# Altium schematic sheet Data Logger.SchDoc
size A; SheetNumber: 5; SheetTotal: 5
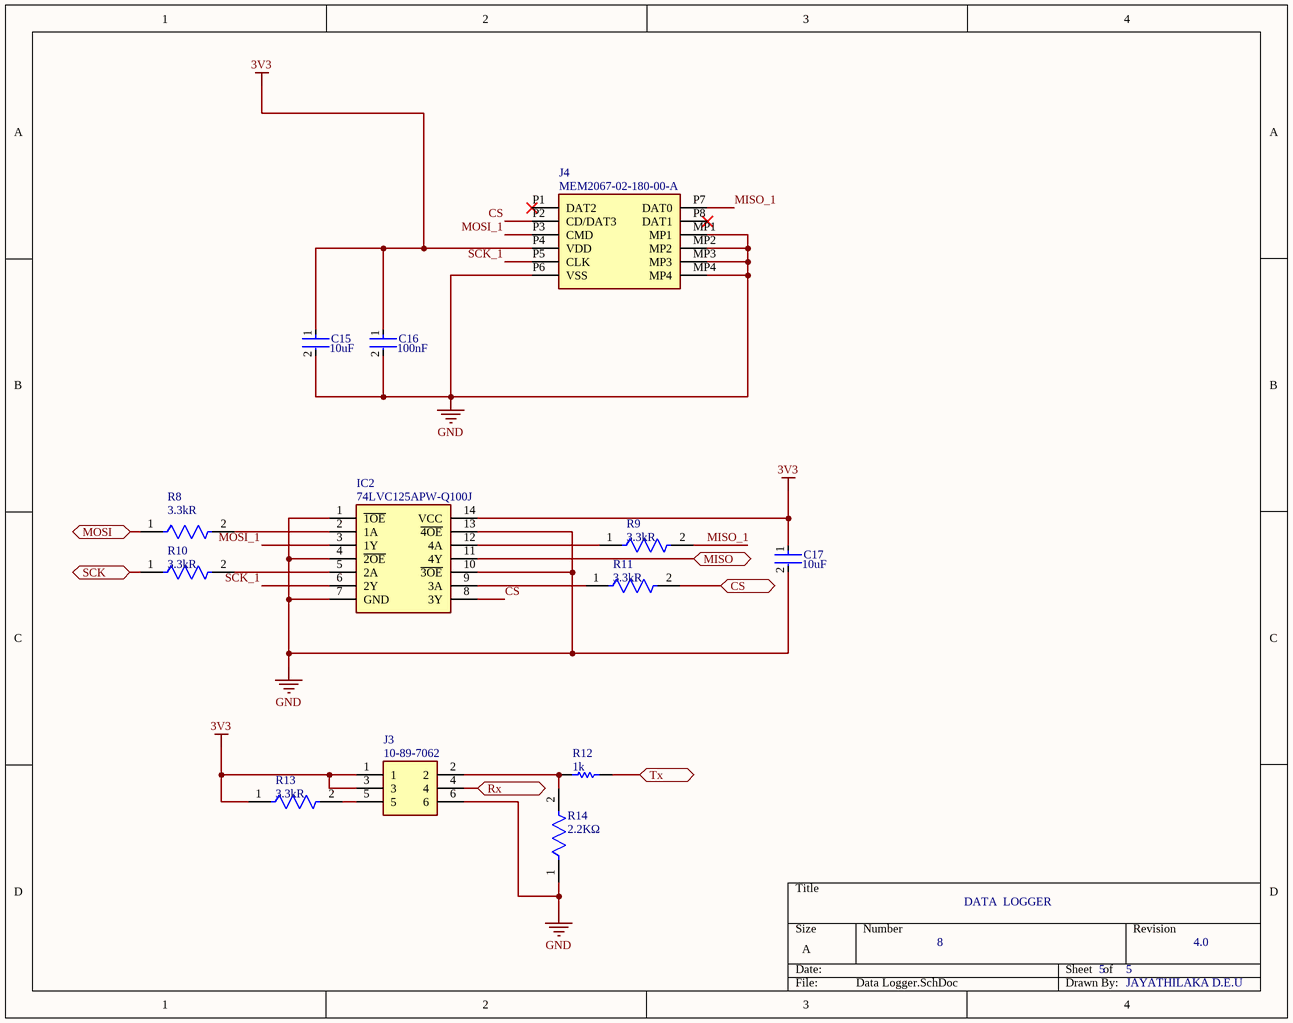
[diagram p0: Data Logger.SchDoc]

## Parts
C15  value 10uF  [FP-CL31B106KBHNNNE-MFG]  (hidden comment: CL31B106KBHNNNE)
C16  Capacitance: 100nF  [FP-GRM31C-0_2-e0_3_0_8-IPC_B]  (hidden comment: GRM31C5C1H104JA01L)
C17  value 10uF  [FP-CL31B106KBHNNNE-MFG]  (hidden comment: CL31B106KBHNNNE)
IC2  74LVC125APW-Q100J  [SOP65P640X110-14N]
J3  10-89-7062  [HDRV6W87P254_2X3_775X508X864P]
J4  MEM2067-02-180-00-A  [MEM20670218000A]
R8  Resistance: 3.3kR  [FP-CRCW1206-e3-MFG]  (hidden comment: CRCW12063K30FKEA)
R9  Resistance: 3.3kR  [FP-CRCW1206-e3-MFG]  (hidden comment: CRCW12063K30FKEA)
R10  Resistance: 3.3kR  [FP-CRCW1206-e3-MFG]  (hidden comment: CRCW12063K30FKEA)
R11  Resistance: 3.3kR  [FP-CRCW1206-e3-MFG]  (hidden comment: CRCW12063K30FKEA)
R12  value 1k  [RESC3116X65X40ML10T20]  (hidden comment: RT1206FRE071KL)
R13  Resistance: 3.3kR  [FP-CRCW1206-e3-MFG]  (hidden comment: CRCW12063K30FKEA)
R14  value 2.2KΩ  [FP-RT1206-MFG]  (hidden comment: RT1206BRD072K2L)

## Ports
CS (bidir, see Farm Assistor[4B], MCU[2C]), MISO (bidir, see Farm Assistor[4B], MCU[3C]), MOSI (bidir, see Farm Assistor[4B], MCU[3C]), Rx (bidir, see Farm Assistor[4B], MCU[2B]), SCK (bidir, see Farm Assistor[4B], MCU[3C]), Tx (bidir, see Farm Assistor[4B], MCU[2B])

## Nets
3V3: C15.1 C16.1 C17.1 IC2.14(VCC) J3.1 J3.3 J4.P4(VDD) R13.1
GND: C15.2 C16.2 C17.2 IC2.1(~{1OE}) IC2.4(~{2OE}) IC2.7(GND) IC2.10(~{3OE}) IC2.13(~{4OE}) J3.6 J4.MP1 J4.MP2 J4.MP3 J4.MP4 J4.P6(VSS) R14.1
CS: IC2.8(3Y) J4.P2(CD/DAT3)
CS: R11.2 ; port CS  [a separate net that carries the same name]
MISO: IC2.11(4Y) ; port MISO
MISO_1: J4.P7(DAT0) R9.2
MOSI: R8.1 ; port MOSI
MOSI_1: IC2.3(1Y) J4.P3(CMD)
Rx: J3.4 ; port Rx
SCK: R10.1 ; port SCK
SCK_1: IC2.6(2Y) J4.P5(CLK)
Tx: R12.2 ; port Tx
NetIC2_2: IC2.2(1A) R8.2
NetIC2_5: IC2.5(2A) R10.2
NetIC2_9: IC2.9(3A) R11.1
NetIC2_12: IC2.12(4A) R9.1
NetJ3_2: J3.2 R12.1 R14.2
NetJ3_5: J3.5 R13.2

Not connected (* = marked no-connect by the designer): J4 P1(DAT2)* P8(DAT1)*

## Notes on the sheet
- DATA  LOGGER
- 8
- 5
- 4.0
- JAYATHILAKA D.E.U

## Library data of the parts
C15 C17 = CMP-2000-07530-2: CAP CER 10UF 50V X7R 1206; Manufacturer: Samsung; Tolerance: 10%; Material: Ceramic; Temperature Coefficient: 15%; Temperature Characteristic: X7R; Digikey Description: CAP CER 10UF 50V X7R 1206; Device Class L1: Passive Components; Lead Free: Yes; Device Class L3: Ceramic Capacitors; Octopart: https://octopart.com/cl31b106kbhnnne-samsung-30507377; ComponentLink2URL: http://www.samsungsem.com/global/front/downloadcms.do?path=%2F%2Fglobal%2F%2Fsupport%2F%2Fproduct-search%2F%2Fmlcc%2F%2F__icsFiles%2F%2Fafieldfile%2F%2F2019%2F%2F06%2F%2F18&fileName=CL31B106KBHNNNE-19.pdf; Voltage Rating: 50V; Temperature Range Low: -55°C; RoHS: TRUE; Temperature: -55°C to +125°C; Category: Cap; ComponentLink2Description: Datasheet; Manufacturer Part Number: CL31B106KBHNNNE; Automotive: No; Device Class L2: Capacitors; Capacitance: 10uF; Height: 1.8mm; Temperature Range High: +125°C; Package: CL31B106KBHNNNE
C16 = CMP-06035-003994-1: Chip Multilayer Ceramic Capacitors for General Purpose, 1206, 0.10uF, C0G, 30ppm/°C, 5%, 50V; Voltage: 50V; Package Quantity: 1; Min Operating Temperature: -55°C; Termination: SMD/SMT; Voltage Rating (DC): 50V; Thickness: 0.071inch; Max Operating Temperature: 125°C; Mount: Surface Mount; Height: 1.6mm; Weight: 0.000571oz; Length: 3.2mm; Case Code (Imperial): 1206; Tolerance: 5%; Lead Free: Lead Free; Material: Ceramic; REACH SVHC: No SVHC; Depth: 1.6mm; Case/Package: 1206; Radiation Hardening: No; Temperature Coefficient: 30ppm/°C; Packaging: Tape and Reel; Case Code (Metric): 3216; Dielectric: C0G; Width: 0.063inch; Voltage Rating: 50V
IC2 = 74LVC125APW-Q100J: Integrated Circuit; Manufacturer_Name: Nexperia; Datasheet Link: https://assets.nexperia.com/documents/data-sheet/74LVC125A_Q100.pdf; Height: 1.1mm; Manufacturer_Part_Number: 74LVC125APW-Q100J; Mouser Part Number: 771-74LVC125APWQ100J; Mouser Price/Stock: https://www.mouser.co.uk/ProductDetail/Nexperia/74LVC125APW-Q100J?qs=fi7yB2oewZnvEQIDK5FFLg%3D%3D; Arrow Part Number: 74LVC125APW-Q100J; Arrow Price/Stock: https://www.arrow.com/en/products/74lvc125apw-q100j/nexperia?region=europe
J3 = 10-89-7062: Connector; Manufacturer_Name: Molex; Datasheet Link: https://componentsearchengine.com/Datasheets/1/10-89-7062.pdf; Height: 8.64mm; Manufacturer_Part_Number: 10-89-7062; Mouser Part Number: 538-10-89-7062; Mouser Price/Stock: https://www.mouser.co.uk/ProductDetail/Molex/10-89-7062?qs=tRPrwvvr%2Fuh8n6rY9aRt4Q%3D%3D
J4 = MEM2067-02-180-00-A: Connector; Manufacturer_Name: GCT (GLOBAL CONNECTOR TECHNOLOGY); Datasheet Link: https://gct.co/files/drawings/mem2067.pdf; Height: 1.95mm; Manufacturer_Part_Number: MEM2067-02-180-00-A; Mouser Part Number: 640-MEM20670218000A; Mouser Price/Stock: https://www.mouser.co.uk/ProductDetail/GCT/MEM2067-02-180-00-A?qs=KUoIvG%2F9IlYTw%2Fcc1GlNJA%3D%3D
R8-R11 R13 = CMP-2100-03617-2: RES Thick Film, 3.3kΩ, 1%, 0.25W, 100ppm/°C, 1206; Max Power Dissipation: 250mW; Voltage Rating (DC): 200V; Tolerance: 1%; Length: 3.2mm; Case Code (Metric): 3216; Contact Plating: Tin; Radiation Hardening: No; Lead Free: Lead Free; Max Operating Temperature: 155°C; Packaging: Tape and Reel; Power Rating: 250mW; Features: Automotive AEC-Q200; Weight: 0.000353oz; Temperature Coefficient: 100ppm/°C; Width: 1.6mm; Depth: 1.6mm; Number of Terminations: 2; Case Code (Imperial): 1206; Military Standard: Not; Height: 0.55mm; Composition: Thick Film; Min Operating Temperature: -55°C; Package Quantity: 10; Case/Package: 1206; Voltage Rating: 200V; Termination: SMD/SMT
R12 = CMP-2003-04306-1: Manufacturer: Yageo; Part Number: RT1206FRE071KL
R14 = CMP-2003-04098-2: RES 2.20K OHM 1/4W .1% SMD 1206; Manufacturer: Yageo; Tolerance: 0.005; Power Rating: 0.25W; Temperature Coefficient: 25 ppm/°C; Description: RT1206 2.2KΩ 0.25W 25 ppm/°C 0.50%; Voltage Rating: 200V; Lead Free: Yes; Manufacturer Part Number: RT1206BRD072K2L; ComponentLink2URL: http://www.yageo.com/documents/recent/PYu-RT_1-to-0.01_RoHS_L_9.pdf; Device Class L1: Passive Components; ComponentLink2Description: Datasheet; Series: RT; Mouser Description: Thin Film Resistors - SMD 1/4W 2.2K ohm .1% 25ppm; Digikey Description: RES 2.20K OHM 1/4W .1% SMD 1206; Composition: Thin Film; Device Class L2: Resistors; Device Class L3: Chip SMD Resistors; Octopart: https://octopart.com/rt1206brd072k2l-yageo-1194112; Package: RT1206; Height: 0.65mm; Category: Res; RoHS: TRUE; Ipc Land Pattern Name: RESC310160X55; Footprint Url: http://www.yageo.com/exep/pages/download/literatures/PYu-R_Mount_10.pdf; Temperature Range High: +155°C; Automotive: No; Temperature Range Low: -55°C; Temperature: -55°C to +155°C; Resistance: 2.2KΩ